# EAGLE design copper (EAGLE 5.06)
REV: A; TITLE: Copper- AVR32 DIP Module
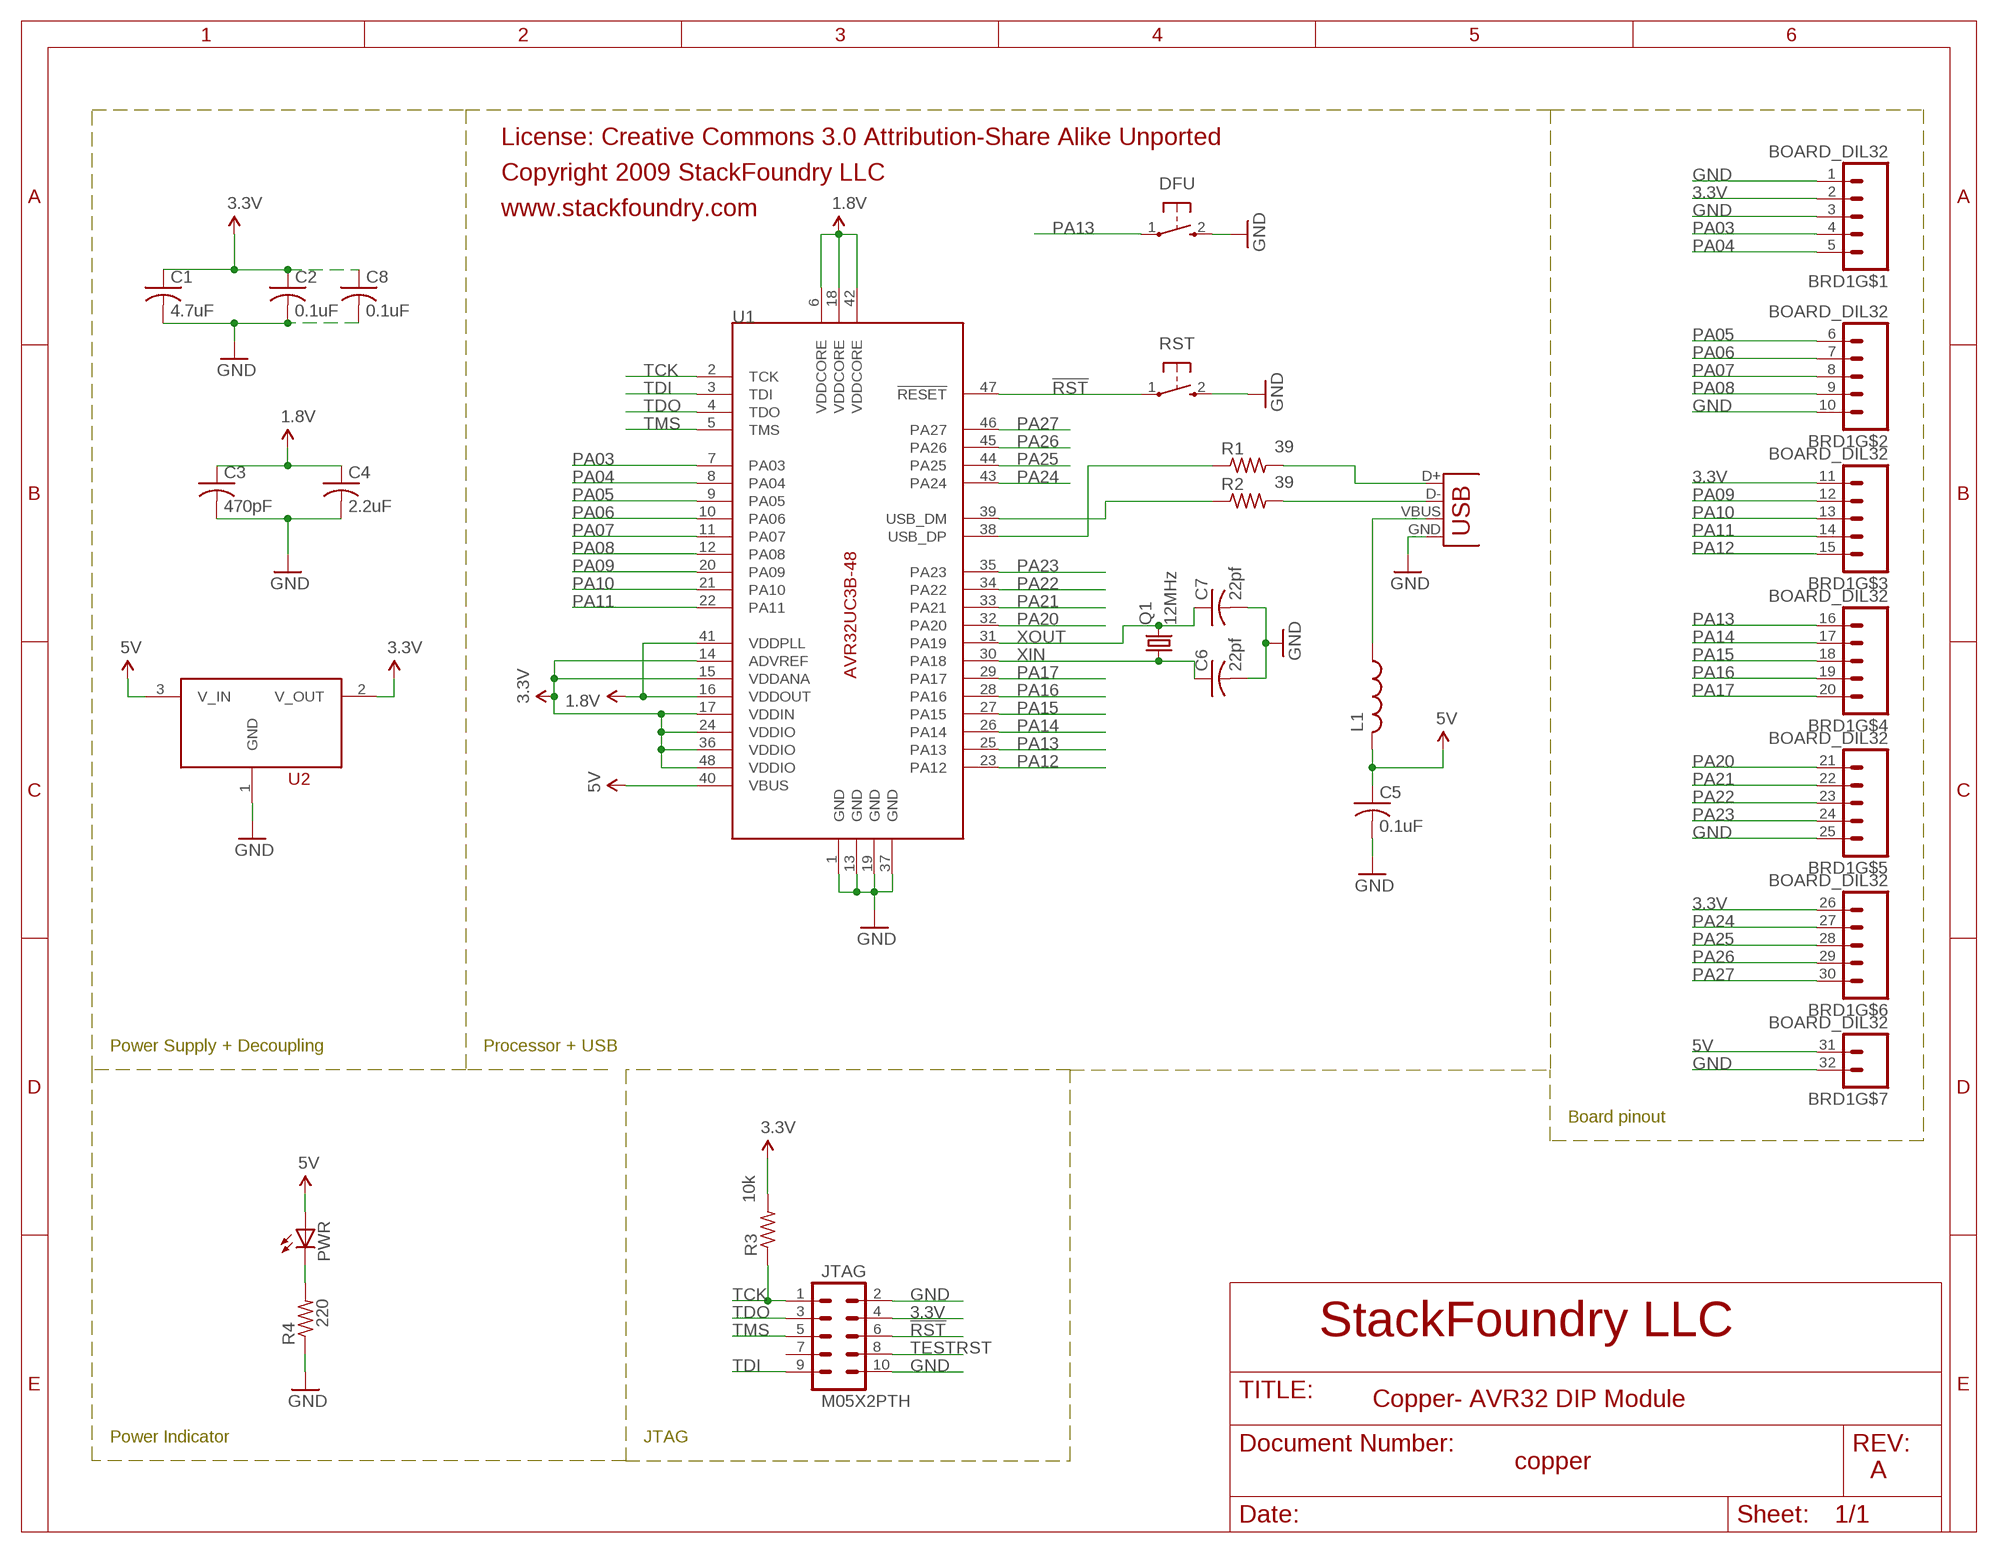
[diagram p0: schematic, sheet 1]

## Parts
BRD1  BOARD_DIL32  [DIL32-NOSILK]
C1  4.7uF  C-USC0603  [C0603]
C2  0.1uF  C-USC0603  [C0603]
C3  470pF  C-USC0603  [C0603]
C4  2.2uF  C-USC0603  [C0603]
C5  0.1uF  C-USC0603  [C0603]
C6  22pf  C-USC0603  [C0603]
C7  22pf  C-USC0603  [C0603]
C8  0.1uF  C-USC0603  [C0603]
DFU  TAC_SWITCH_2PB3U  [OMROM_B3U]
JTAG  M05X2PTH  [AVR_ICSP]
L1  L-USL0805  [L0805]
PWR  LED1206  [LED-1206]
Q1  12MHz  CRYSTAL25X3.2  [CRYSTAL-SMD-5X3.2]
R1  39  R-US_R0603  [R0603]
R2  39  R-US_R0603  [R0603]
R3  10k  R-US_R0603  [R0603]
R4  220  R-US_R0603  [R0603]
RST  TAC_SWITCH_2PB3U  [OMROM_B3U]
U1  AVR32UC3B-48TQFP  [TQFP48]
U2  MCP1700  [SOT23]
X2  USBSMD  [USB-MINIB]

## Nets
1.8V: C3.1 C4.1 U1.6(VDDCORE) U1.16(VDDOUT) U1.18(VDDCORE) U1.41(VDDPLL) U1.42(VDDCORE)
3.3V: BRD1.2 BRD1.11 BRD1.26 C1.1 C2.1 C8.1 JTAG.4 R3.2 U1.14(ADVREF) U1.15(VDDANA) U1.17(VDDIN) U1.24(VDDIO) U1.36(VDDIO) U1.48(VDDIO) U2.2(V_OUT)
5V: BRD1.31 C5.1 L1.2 PWR.A U1.40(VBUS) U2.3(V_IN)
!RST: JTAG.6 RST.1 U1.47(!RESET)
GND: BRD1.1 BRD1.3 BRD1.10 BRD1.25 BRD1.32 C1.2 C2.2 C3.2 C4.2 C5.2 C6.2 C7.2 C8.2 DFU.2 JTAG.2 JTAG.10 R4.1 RST.2 U1.1(GND) U1.13(GND) U1.19(GND) U1.37(GND) U2.1(GND) X2.GND
N$1: R1.1 U1.38(USB_DP)
N$2: R2.1 U1.39(USB_DM)
N$3: L1.1 X2.VBUS
N$4: R1.2 X2.D+
N$5: R2.2 X2.D-
N$6: PWR.C R4.2
PA03: BRD1.4 U1.7(PA03)
PA04: BRD1.5 U1.8(PA04)
PA05: BRD1.6 U1.9(PA05)
PA06: BRD1.7 U1.10(PA06)
PA07: BRD1.8 U1.11(PA07)
PA08: BRD1.9 U1.12(PA08)
PA09: BRD1.12 U1.20(PA09)
PA10: BRD1.13 U1.21(PA10)
PA11: BRD1.14 U1.22(PA11)
PA12: BRD1.15 U1.23(PA12)
PA13: BRD1.16 DFU.1 U1.25(PA13)
PA14: BRD1.17 U1.26(PA14)
PA15: BRD1.18 U1.27(PA15)
PA16: BRD1.19 U1.28(PA16)
PA17: BRD1.20 U1.29(PA17)
PA20: BRD1.21 U1.32(PA20)
PA21: BRD1.22 U1.33(PA21)
PA22: BRD1.23 U1.34(PA22)
PA23: BRD1.24 U1.35(PA23)
PA24: BRD1.27 U1.43(PA24)
PA25: BRD1.28 U1.44(PA25)
PA26: BRD1.29 U1.45(PA26)
PA27: BRD1.30 U1.46(PA27)
TCK: JTAG.1 R3.1 U1.2(TCK)
TDI: JTAG.9 U1.3(TDI)
TDO: JTAG.3 U1.4(TDO)
TESTRST: JTAG.8
TMS: JTAG.5 U1.5(TMS)
XIN: C6.1 Q1.1 U1.30(PA18)
XOUT: C7.1 Q1.3 U1.31(PA19)
Unconnected: JTAG.7

## Notes on the sheet
- License: Creative Commons 3.0 Attribution-Share Alike Unported
- Copyright 2009 StackFoundry LLC
- www.stackfoundry.com
- Power Supply + Decoupling | Processor + USB
- Board pinout
- StackFoundry LLC
- Power Indicator | JTAG

## Library data of the parts
BRD1 = StackFoundry:BOARD_DIL32
C1-C8 = rcl:C-US: CAPACITOR, American symbol
DFU RST = switches:TAC_SWITCH_2P
JTAG = SparkFun:M05X2: Header 5x2 Standard 10-pin dual row 0.1" header. Commonly used with AVR-ISP. Use with Spark Fun Electronics SKU: PRT-00778
L1 = rcl:L-US: INDUCTOR, American symbol
PWR = SparkFun:LED: LEDs Standard schematic elements and footprints for 5mm, 3mm, 1206, and 0603 sized LEDs. 5mm - Spark Fun Electronics SKU : COM-00529 (and others)
Q1 = xtal:CRYSTAL2: Crystals
R1-R4 = rcl:R-US_: RESISTOR, American symbol
U1 = atmel:AVR32UC3B-48: AVR32 UC3B1xxx series microcontroller This is the 48 pin version of the UC3B microcontroller.
U2 = microchip:MCP1700
X2 = StackFoundry:USB: USB Connectors USB-B-PTH is fully proven USB-A-PCB is untested. USB-A-H is throughly reviewed, but untested. USB-B-SMT is throughly reviewed, but untested. USB-A-S has not been used/tested USB-MB-H has not been used/tested

## Board
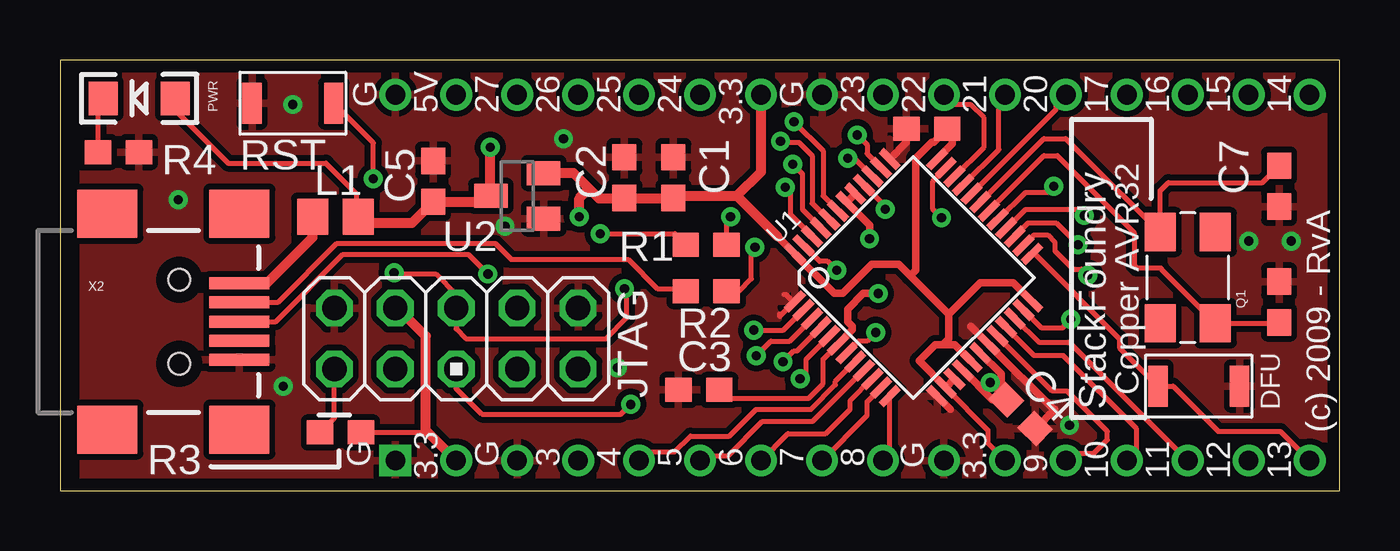
[diagram p1: board, top side]
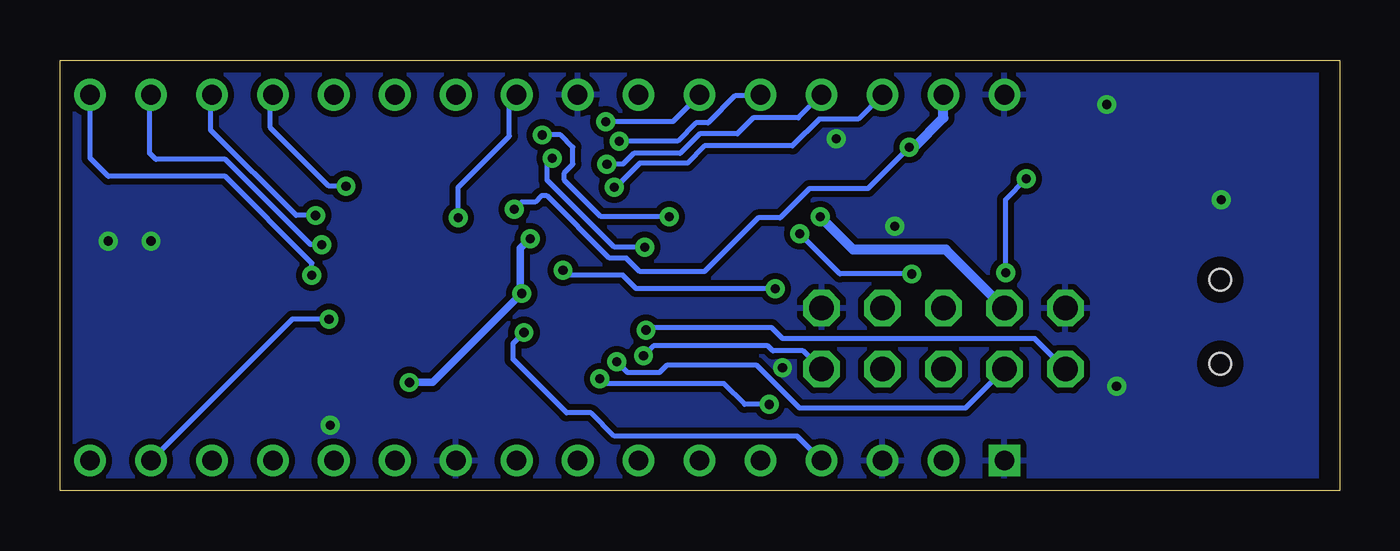
[diagram p2: board, bottom side, seen from below]

Size 53.32 x 17.96 mm. Coordinates in mm from the lower left corner, seen from the top.
Outline: 0,0 53.32,0 53.32,17.96 0,17.96 0,0
Copper layers (1*16): Top 0.035mm / dielectric 1.5mm / Bottom 0.035mm
Design rules "default *": minimum track width 6mil, minimum drill 15mil, track to track 7mil, track to pad 7mil, pad to pad 7mil, via to via 7mil, smd to smd 7mil, copper to edge 20mil, drill to drill 7mil, minimum pad ring 10mil, minimum via ring 8mil, stop-mask expansion 4mil, vias tented up to drill 15mil, thermal gap 10mil

### Footprints (pad centres in the part's own frame; a part is rotated, then mirrored left to right if it is on the bottom)
DIL32-NOSILK = drill 0.813 square: 1 -19.05,-7.62 | drill 0.813 round: 2 -16.51,-7.62; 3 -13.97,-7.62; 4 -11.43,-7.62; 5 -8.89,-7.62; 6 -6.35,-7.62; 7 -3.81,-7.62; 8 -1.27,-7.62; 9 1.27,-7.62; 10 3.81,-7.62; 11 6.35,-7.62; 12 8.89,-7.62; 13 11.43,-7.62; 14 13.97,-7.62; 15 16.51,-7.62; 16 19.05,-7.62; 17 19.05,7.62; 18 16.51,7.62; 19 13.97,7.62; 20 11.43,7.62; 21 8.89,7.62; 22 6.35,7.62; 23 3.81,7.62; 24 1.27,7.62; 25 -1.27,7.62; 26 -3.81,7.62; 27 -6.35,7.62; 28 -8.89,7.62; 29 -11.43,7.62; 30 -13.97,7.62; 31 -16.51,7.62; 32 -19.05,7.62
C0603 = smd 1.1 x 1: 1 -0.85,0; 2 0.85,0
OMROM_B3U = smd 0.8 x 1.7: 1 -1.7,0; 2 1.7,0
AVR_ICSP = drill 1.016 octagon: 1 -1.27,5.08; 2 1.27,5.08; 3 -1.27,2.54; 4 1.27,2.54; 5 -1.27,0; 6 1.27,0; 7 -1.27,-2.54; 8 1.27,-2.54; 9 -1.27,-5.08; 10 1.27,-5.08
L0805 = smd 1.3 x 1.5: 1 -0.95,0; 2 0.95,0
LED-1206 = smd 1.2 x 1.4: A -1.5,0; C 1.5,0
CRYSTAL-SMD-5X3.2 = smd 1.6 x 1.3: 1 -1.9,-1.15; 2 1.9,-1.15; 3 1.9,1.15; 4 -1.9,1.15
R0603 = smd 1.1 x 1: 1 -0.85,0; 2 0.85,0
TQFP48 = smd 1.016 x 0.305: 1 -4.191,2.794; 2 -4.191,2.286; 3 -4.191,1.778; 4 -4.191,1.27; 5 -4.191,0.762; 6 -4.191,0.254; 7 -4.191,-0.254; 8 -4.191,-0.762; 9 -4.191,-1.27; 10 -4.191,-1.778; 11 -4.191,-2.286; 12 -4.191,-2.794; 25 4.191,-2.794; 26 4.191,-2.286; 27 4.191,-1.778; 28 4.191,-1.27; 29 4.191,-0.762; 30 4.191,-0.254; 31 4.191,0.254; 32 4.191,0.762; 33 4.191,1.27; 34 4.191,1.778; 35 4.191,2.286; 36 4.191,2.794 | smd 0.305 x 1.016: 13 -2.794,-4.191; 14 -2.286,-4.191; 15 -1.778,-4.191; 16 -1.27,-4.191; 17 -0.762,-4.191; 18 -0.254,-4.191; 19 0.254,-4.191; 20 0.762,-4.191; 21 1.27,-4.191; 22 1.778,-4.191; 23 2.286,-4.191; 24 2.794,-4.191; 37 2.794,4.191; 38 2.286,4.191; 39 1.778,4.191; 40 1.27,4.191; 41 0.762,4.191; 42 0.254,4.191; 43 -0.254,4.191; 44 -0.762,4.191; 45 -1.27,4.191; 46 -1.778,4.191; 47 -2.286,4.191; 48 -2.794,4.191
SOT23 = smd 1 x 1.4: 1 -0.95,-1.1; 2 0.95,-1.1; 3 0,1.1
USB-MINIB = smd 2.5 x 0.5: D+ 2.5,0; D- 2.5,0.8; GND 2.5,-1.6; ID 2.5,-0.8; VBUS 2.5,1.6 | smd 2.5 x 2: GND@1 -3,-4.5; GND@2 -3,4.5; GND@3 2.5,4.5; GND@4 2.5,-4.5 | hole 0.9: 0,1.75; 0,-1.75

### Placement (x,y rotation side)
BRD1  33.02,8.89 0 top
C1  25.55,13.06 90 top
C2  23.52,13.06 90 top
C3  26.62,4.22 180 top
C4  40.03,3.2 315 top
C5  15.54,12.9 90 top
C6  50.8,7.87 90 top
C7  50.8,12.7 270 top
C8  36.12,15.09 180 top
DFU  47.45,4.37 0 top
JTAG  16.51,6.35 90 top
L1  11.48,11.43 0 top
PWR  3.3,16.36 180 top
Q1  46.99,8.89 90 top
R1  26.92,10.26 180 top
R2  26.92,8.33 180 top
R3  11.68,2.44 0 top
R4  2.44,14.12 180 top
RST  9.7,16.15 180 top
U1  35.56,8.89 45 top
U2  19.05,12.29 90 top
X2  4.98,7.06 0 top

### Tracks (layer width: path | path; a pad name or v marks a point on that pad's centre or on a via)
1.8V  (via drill 0.38)
  Top 0.203: C3.1 27.82,3.86 31.19,3.86 31.8,4.47 31.8,5.49 U1.6
  Top 0.305: 39.35,3.8 C4.1 | 39.35,3.8 38.91,3.8 | 38.91,3.8 38.85,3.8 U1.16 | U1.18 39.22,4.88 39.22,4.11 38.91,3.8 | 39.35,3.8 39.35,3.93 v38.76,4.52 | v34.09,8.23 33.48,8.23 32.82,7.57 32.82,7.06 33.02,6.86 33.02,6.71 U1.6 | v33.73,10.52 33.73,11.08 U1.42 U1.41
  Bottom 0.305: v38.76,4.52 37.8,4.52 34.14,8.18 | v34.09,8.23 34.14,8.18 | 34.14,8.18 34.14,10.11 v33.73,10.52
3.3V  (via drill 0.38)
  Top 0.203: U1.14 36.91,4.29 38.66,2.54 38.66,1.98 BRD1.11 | 14.07,7.62 JTAG.4 | R3.2 15.14,2.44 15.24,2.54
  Top 0.305: 29.87,10.62 29.88,10.62 U1.48 30.62,9.87 32.26,8.23 32.61,8.23 33.83,9.45 34.95,9.45 35.43,8.97 | U1.15 U1.14 35.8,5.42 36.47,6.1 36.78,6.1 | U1.17 37.29,6.1 36.78,6.1 | U1.24 40.5,7.91 39.73,8.69 38.35,8.69 37.03,7.37 | 37.03,7.37 37.03,6.35 36.78,6.1 | 35.43,8.97 37.03,7.37 | 35.43,8.97 35.66,9.2 35.66,13.87 36.32,14.53 36.41,14.53 C8.1 37.19,14.87 37.19,14.48 U1.36
  Top 0.406: C2.1 C1.1 25.64,12.29 28.2,12.29 | C2.1 23.35,12.38 | 28.2,12.29 29.88,10.62 | 14.07,7.62 15.24,6.45 15.24,2.54 BRD1.2 | BRD1.26 29.21,13.3 28.2,12.29 | 22.05,12.6 21.4,13.24 U2.2 20.02,13.38 | 22.05,12.6 22.45,12.19 23.51,12.19 C2.1 | v21.64,11.43 21.64,12.19 22.05,12.6
  Bottom 0.406: JTAG.4 16.41,10.06 20.27,10.06 v21.64,11.43
5V  (via drill 0.38)
  Top 0.203: U2.3 17.93,12.31 | v34.39,11.73 34.39,11.85 U1.40 | PWR.A 4.8,15.87 7.01,13.66 11.07,13.66 12.34,12.39 12.34,11.67 L1.2
  Top 0.406: C5.1 15.38,11.89 | U2.3 17.33,12.05 C5.1 | C5.1 14.67,11.18 12.69,11.18 L1.2 | 17.93,12.31 v17.93,14.33
  Bottom 0.203: v17.93,14.33 19.66,12.6 22.1,12.6 23.32,11.38 24.23,11.38 26.47,9.14 29.16,9.14 29.72,9.7 30.43,9.7 33.02,12.29 33.27,12.29 33.53,12.04 34.09,12.04 v34.39,11.73
  Bottom 0.406: v17.93,14.33 17.73,14.33 16.51,15.54 BRD1.31
!RST  (via drill 0.38)
  Top 0.203: v23.52,8.43 23.62,8.33 23.62,7.21 22.76,6.35 16.92,6.35 16.51,6.76 JTAG.6 16.51,8.18 15.65,9.04 14.17,9.04 v13.92,9.09 | U1.47 31.65,9.57 31.99,9.57 v32.36,9.2 | v13.06,13.01 13.06,14.5 RST.1
  Bottom 0.203: v23.52,8.43 29.31,8.43 29.87,8.99 32.16,8.99 v32.36,9.2 | v13.92,9.09 13.92,12.14 v13.06,13.01
GND  (via drill 0.38)
  Top 0.203: 29.97,7.37 30.09,7.37 | 30.18,8.18 30.26,8.18 30.54,7.9 U1.1 29.97,7.26
  Top 0.305: U1.13 37.08,3.4 | U1.19 | U1.19 39.27,5.54 | U1.19 37.95,6.86 | C4.2 40.65,2.6 41.45,3.4 41.4,3.4 U1.19 | C8.2 35.27,14.53 U1.37
  other vias: 42.06,2.74 9.3,4.37 23.22,5.13 49.53,10.41 51.31,10.41 18.54,11.02 20.98,14.68 4.93,12.14 9.7,16.1
  pour Top (isolate 0.254): 0.91,18.29 53.09,18.29 53.09,-0.76 0.97,-0.76 0.97,17.32
  pour Bottom (isolate 0.254): 1.22,17.63 53.04,17.63 53.04,-0.56 0.97,-0.56 0.97,17.68 1.12,17.68
N$1  (via drill 0.38)
  Top 0.203: R1.1 27.77,11.26 v27.94,11.43 | v33.22,14.83 33.63,14.43 33.63,14.05 U1.38
  Bottom 0.203: v27.94,11.43 30.79,11.43 32.31,12.95 32.31,13.26 31.95,13.61 31.95,14.33 32.46,14.83 v33.22,14.83
N$2  (via drill 0.38)
  Top 0.203: v32.82,13.87 33.1,13.87 U1.39 | R2.1 28.3,8.33 28.8,8.84 28.8,10.01 v28.96,10.16
  Bottom 0.203: 30.56,10.49 30.38,10.31 | 30.56,10.49 33.02,12.95 33.02,13.66 v32.82,13.87 | v28.96,10.16 30.23,10.16 30.56,10.49
N$3
  Top 0.406: X2.VBUS 8.62,8.66 10.53,10.57 L1.1
N$4  (via drill 0.38)
  Top 0.203: v22.5,10.72 25.62,10.72 R1.2 | X2.D+ 8.99,7.06 11.79,9.86 17.02,9.86 v17.83,9.04
  Bottom 0.203: v17.83,9.04 20.83,9.04 v22.5,10.72
N$5
  Top 0.203: R2.2 25.97,8.43 24.89,8.43 23.67,9.65 18.8,9.65 18.14,10.31 11.53,10.31 9.09,7.87 7.49,7.87 X2.D-
N$6
  Top 0.203: R4.2 1.59,16.14 PWR.C
PA03  (via drill 0.38)
  Top 0.203: U1.7 32.78,5.8 32.83,5.8 33.27,6.25 33.63,6.25 v33.98,6.6
  Bottom 0.203: BRD1.4 22.61,2.29 30.23,2.29 31.19,3.25 32.21,3.25 34.44,5.49 34.44,6.15 v33.98,6.6
PA04
  Top 0.203: U1.8 33.12,5.39 32.31,4.57 32.31,4.42 31.29,3.4 29.01,3.4 27.89,2.29 26.26,2.29 25.6,1.63 24.49,1.63 BRD1.5
PA05
  Top 0.203: 33.48,5.03 U1.9 31.36,2.9 29.26,2.9 27.84,1.47 26.87,1.47 BRD1.6
PA06
  Top 0.203: U1.10 33.83,4.67 32.92,3.76 32.92,3.4 31.9,2.39 30.33,2.39 BRD1.7
PA07
  Top 0.203: 34.21,4.29 U1.11 33.63,3.73 33.63,3.15 BRD1.8
PA08
  Top 0.203: U1.12 34.57,1.55 BRD1.9
PA09
  Top 0.203: U1.20 39.06,6.46 41.35,4.17 41.96,4.17 43.64,2.49 43.64,2.13 43.08,1.57 42.22,1.57 BRD1.12
PA10
  Top 0.203: U1.21 39.42,6.81 40.59,5.64 41.81,5.64 44.86,2.59 44.86,1.68 BRD1.13
PA11
  Top 0.203: U1.22 39.81,7.18 40.79,6.2 42.06,6.2 BRD1.14
PA12  (via drill 0.38)
  Top 0.203: U1.23 40.88,6.81 41.81,6.81 41.81,6.86 v42.11,7.16
  Bottom 0.203: v42.11,7.16 43.64,7.16 BRD1.15
PA13
  Top 0.203: U1.25 40.62,9.88 44.15,6.35 44.15,5.97 DFU.1 46.38,4.37 48.26,2.49 50.85,2.49 BRD1.16
PA14  (via drill 0.38)
  Top 0.203: U1.26 40.16,10.24 40.59,10.67 41.15,10.67 41.45,10.36 41.45,10.01 42.22,9.25 42.57,9.25 v42.82,8.99
  Bottom 0.203: v42.82,8.99 42.82,9.5 46.43,13.11 51.31,13.11 52.07,13.87 BRD1.17
PA15  (via drill 0.38)
  Top 0.203: U1.27 39.78,10.62 40.34,11.18 41.5,11.18 v42.42,10.26
  Bottom 0.203: v42.42,10.26 42.88,10.26 46.43,13.82 49.33,13.82 49.58,14.07 49.58,16.46 BRD1.18
PA16  (via drill 0.38)
  Top 0.203: U1.28 39.45,10.96 40.23,11.73 42.42,11.73 v42.67,11.48
  Bottom 0.203: v42.67,11.48 43.48,11.48 47.04,15.04 47.04,16.46 BRD1.19
PA17  (via drill 0.38)
  Top 0.203: U1.29 39.1,11.31 40.23,12.45 41.15,12.45 v41.4,12.7
  Bottom 0.203: v41.4,12.7 42.11,12.7 44.55,15.14 44.55,16.41 BRD1.20
PA20
  Top 0.203: U1.32 37.99,12.39 41.5,15.9 41.5,16.1 BRD1.21
PA21
  Top 0.203: U1.33 37.64,12.75 39.12,14.22 39.12,16.26 BRD1.22
PA22
  Top 0.203: U1.34 37.29,13.11 38.51,14.33 38.51,15.54 37.95,16.1 37.24,16.1 BRD1.23
PA23  (via drill 0.38)
  Top 0.203: 36.91,13.49 U1.35 36.91,13.44 36.37,12.9 36.37,11.73 v36.73,11.38
  Bottom 0.203: v36.73,11.38 36.73,12.65 34.59,14.78 34.59,16.2 BRD1.24
PA24  (via drill 0.38)
  Top 0.203: U1.43 31.8,12.29 31.8,14.17 v30.58,15.39
  Bottom 0.203: v30.58,15.39 27.79,15.39 BRD1.27
PA25  (via drill 0.38)
  Top 0.203: U1.44 32.02,11.31 31.34,11.99 31.34,13.97 30.79,14.53 30.07,14.53 v30.02,14.58
  Bottom 0.203: v30.02,14.58 27.58,14.58 26.82,15.34 26.31,15.34 25.2,16.46 24.18,16.46 BRD1.28
PA26  (via drill 0.38)
  Top 0.203: U1.45 31.7,10.97 30.94,11.73 30.94,13.21 v30.53,13.61
  Bottom 0.203: v30.53,13.61 29.87,13.61 29.41,14.07 27.48,14.07 26.67,14.88 25.09,14.88 24.43,15.54 22.55,15.54 BRD1.29
PA27  (via drill 0.38)
  Top 0.203: U1.46 31.34,10.62 30.43,11.53 30.43,12.65 v30.23,12.65
  Bottom 0.203: v30.23,12.65 29.97,12.85 29.16,13.66 27.18,13.66 26.47,14.38 22.81,14.38 21.69,15.49 20.07,15.49 BRD1.30
TCK  (via drill 0.38)
  Top 0.203: 30.98,7.51 U1.2 30.14,6.71 v28.91,6.71 | JTAG.1 11.43,3.03 R3.1
  Bottom 0.203: JTAG.1 12.7,6.35 23.22,6.35 23.67,6.81 28.8,6.81 v28.91,6.71
TDI  (via drill 0.38)
  Top 0.203: 31.31,7.18 U1.3 30.4,6.25 29.62,6.25 v29.01,5.64
  Bottom 0.203: JTAG.9 22.35,5.84 23.62,5.84 23.82,6.04 28.6,6.04 v29.01,5.64
TDO  (via drill 0.38)
  Top 0.203: 31.67,6.82 U1.4 30.72,5.84 30.58,5.84 v30.12,5.38
  Bottom 0.203: JTAG.3 15.6,3.45 22.5,3.45 24.28,5.23 28.04,5.23 28.35,4.93 29.67,4.93 v30.12,5.38
TMS  (via drill 0.38)
  Top 0.203: JTAG.5 16.51,4.27 17.58,3.2 23.37,3.2 v23.77,3.61 | U1.5 32.06,6.46 31.09,5.49 31.09,4.88 v30.84,4.67
  Bottom 0.203: v23.77,3.61 24.79,3.61 25.65,4.47 30.63,4.47 v30.84,4.67
XIN
  Top 0.203: U1.30 41,13.97 41.55,13.97 44.76,10.77 44.76,9.4 44.86,9.3 45.88,9.3 45.88,9.25 Q1.1 50.77,6.99 C6.1 50.78,7.04
XOUT
  Top 0.203: U1.31 41,14.68 41.9,14.68 43.68,12.9 | 43.68,12.9 Q1.3 45.84,12.52 46.18,12.85 50.1,12.85 C7.1 | 43.68,12.9 43.47,13.11

### Text on the board
tPlace: G | 5V | 27 | 26 | 25 | 24 | G | 23 | 22 | 21 | 20 | 17 | 16 | 15 | 14 | 3.3 | Copper AVR32 | StackFoundry | (c) 2009 - RvA | G | 3.3 | G | 3 | 4 | 5 | 6 | 7 | 8 | G | 3.3 | 9 | 10 | 11 | 12 | 13